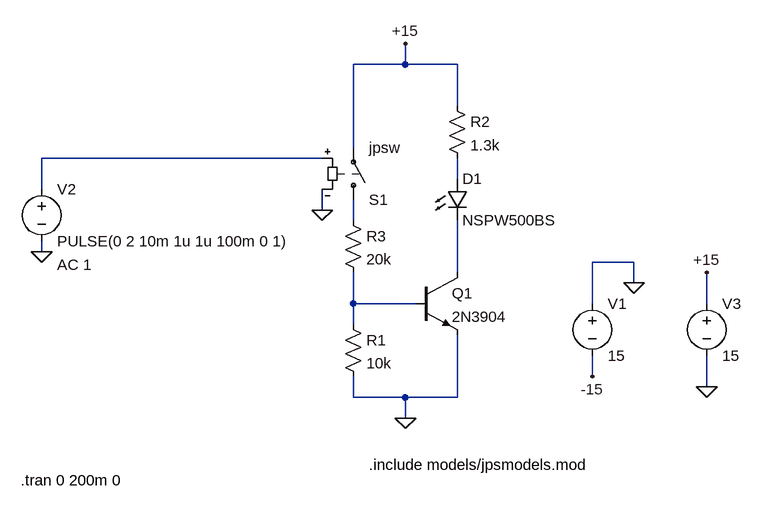
[diagram p0: schematic connect_detect.asc]
connect_detect.asc, the LTspice schematic file:
Version 4
SHEET 1 880 680
WIRE 144 -176 144 -208
WIRE 144 -176 64 -176
WIRE 224 -176 144 -176
WIRE 224 -112 224 -176
WIRE 64 -48 64 -176
WIRE 16 -32 -416 -32
WIRE 224 0 224 -32
WIRE -416 16 -416 -32
WIRE 16 48 16 16
WIRE 64 64 64 32
WIRE -416 112 -416 96
WIRE 496 128 432 128
WIRE 224 144 224 64
WIRE 496 160 496 128
WIRE 64 192 64 144
WIRE 160 192 64 192
WIRE 432 192 432 128
WIRE 608 192 608 144
WIRE 64 224 64 192
WIRE 432 304 432 272
WIRE 608 320 608 272
WIRE 64 336 64 304
WIRE 144 336 64 336
WIRE 224 336 224 240
WIRE 224 336 144 336
WIRE 144 368 144 336
FLAG 496 160 0
FLAG 432 304 -15
FLAG -416 112 0
FLAG 16 48 0
FLAG 608 320 0
FLAG 608 144 +15
FLAG 144 368 0
FLAG 144 -208 +15
SYMBOL npn 160 144 R0
SYMATTR InstName Q1
SYMATTR Value 2N3904
SYMBOL voltage 432 176 R0
WINDOW 123 0 0 Left 0
WINDOW 39 0 0 Left 0
SYMATTR InstName V1
SYMATTR Value 15
SYMBOL res 48 208 R0
SYMATTR InstName R1
SYMATTR Value 10k
SYMBOL LED 208 0 R0
SYMATTR InstName D1
SYMATTR Value NSPW500BS
SYMATTR Description Diode
SYMATTR Type diode
SYMBOL res 208 -128 R0
SYMATTR InstName R2
SYMATTR Value 1.3k
SYMBOL res 48 48 R0
SYMATTR InstName R3
SYMATTR Value 20k
SYMBOL sw 64 48 M180
SYMATTR InstName S1
SYMATTR Value jpsw
SYMBOL voltage -416 0 R0
WINDOW 123 24 132 Left 0
WINDOW 39 0 0 Left 0
SYMATTR Value2 AC 1
SYMATTR InstName V2
SYMATTR Value PULSE(0 2 10m 1u 1u 100m 0 1)
SYMBOL voltage 608 176 R0
WINDOW 123 0 0 Left 0
WINDOW 39 0 0 Left 0
SYMATTR InstName V3
SYMATTR Value 15
TEXT 88 440 Left 0 !.include models/jpsmodels.mod
TEXT -448 464 Left 0 !.tran 0 200m 0

The netlist it stands for:
* connect_detect.asc
Q1 N004 N005 0 0 2N3904
V1 0 -15 15
R1 N005 0 10k
D1 N002 N004 NSPW500BS
R2 +15 N002 1.3k
R3 N003 N005 20k
S1 N003 +15 N001 0 jpsw
V2 N001 0 PULSE(0 2 10m 1u 1u 100m 0 1) AC 1
V3 +15 0 15
.model D D
.lib standard.dio
.model NPN NPN
.model PNP PNP
.lib standard.bjt
.include models/jpsmodels.mod
.tran 0 200m 0
.backanno
.end